# EAGLE design SparkFun_SOIC8-DIP-Adapter (EAGLE 7.3.0)
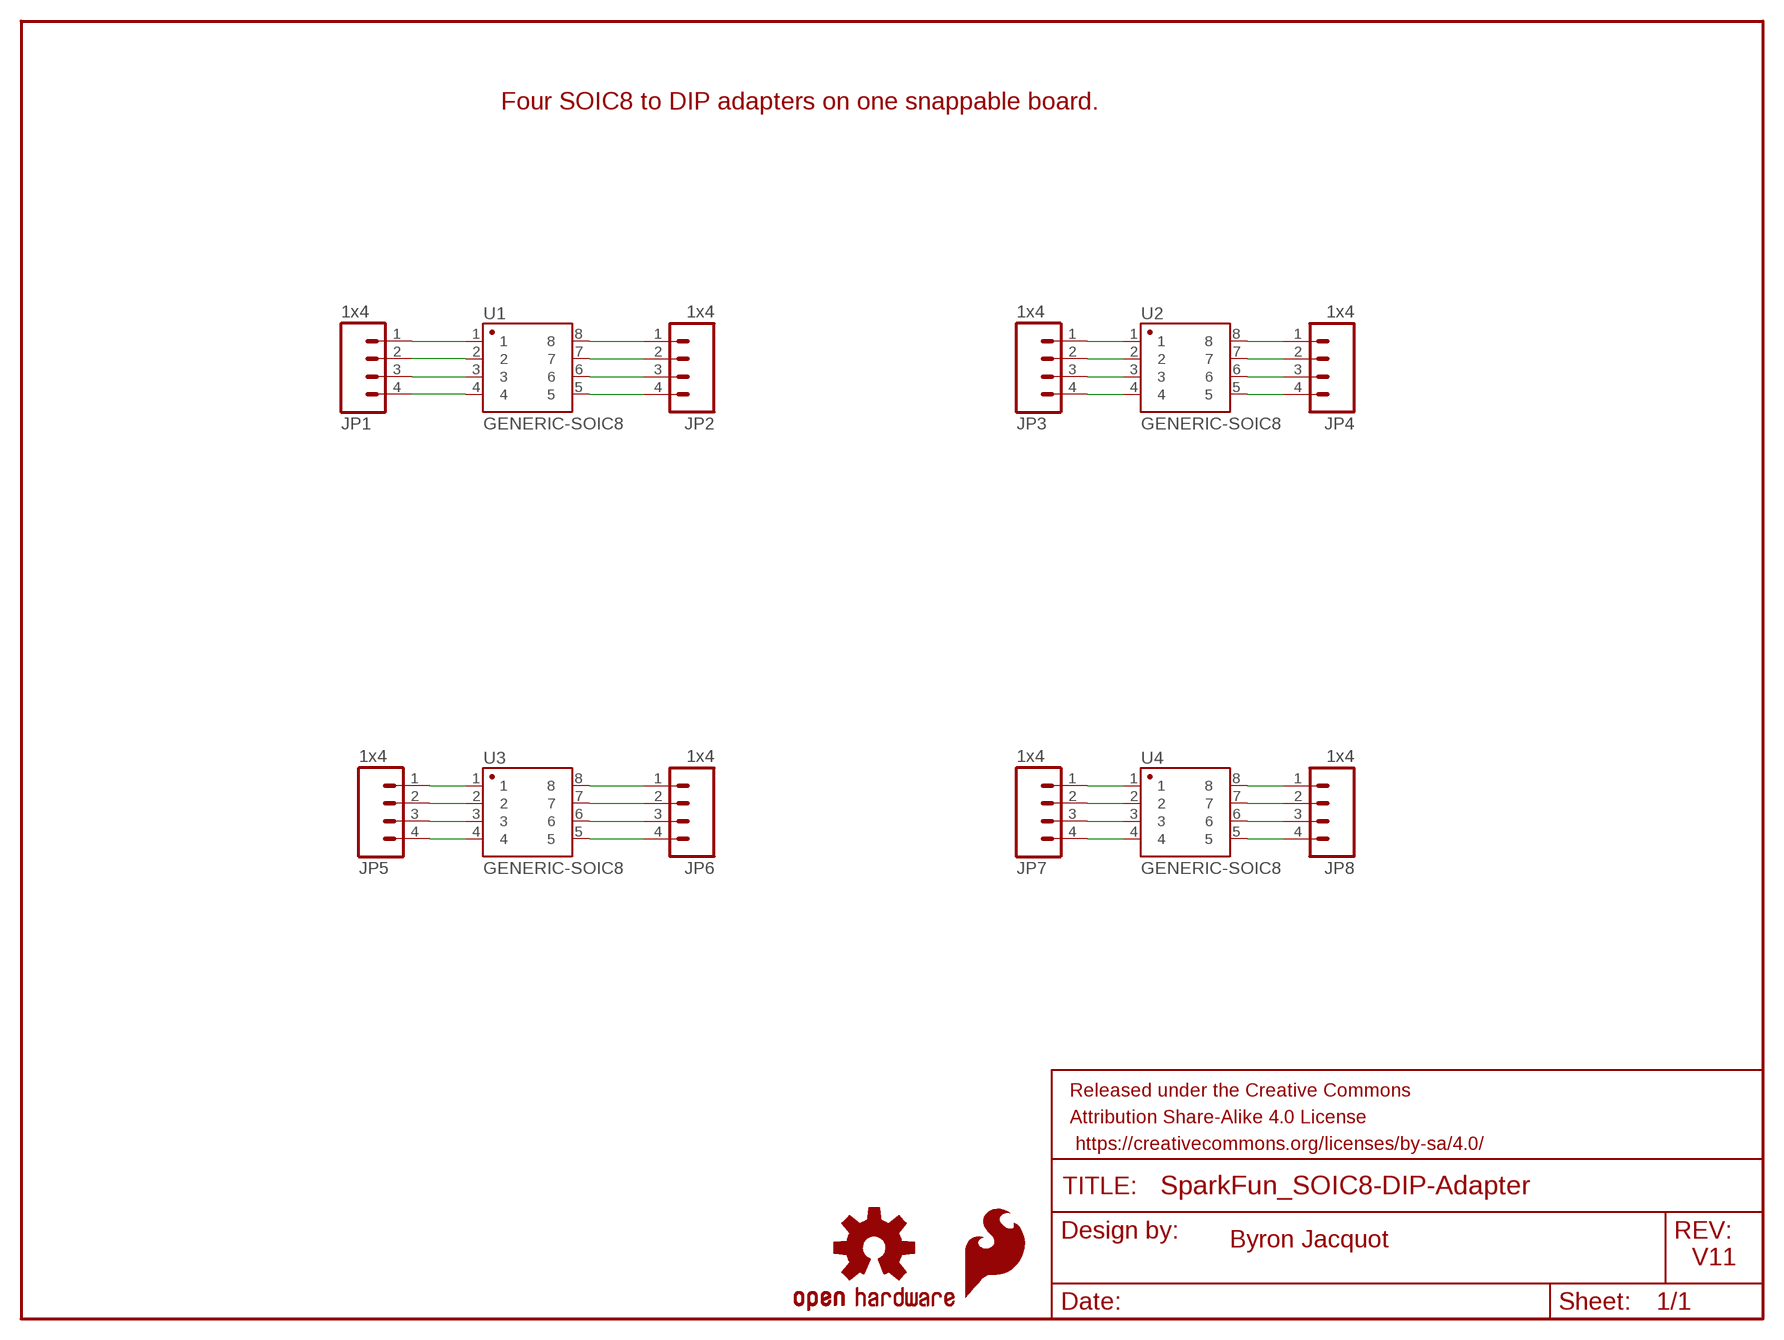
[diagram p0: schematic, sheet 1]

## Parts
FRAME1  frame  FRAME-LETTER  [CREATIVE_COMMONS]
JP1  1x4  M041X04_NO_SILK  [1X04_NO_SILK]
JP2  1x4  M04NO_SILK_ALL_ROUND  [1X04_NO_SILK_ALL_ROUND]
JP3  1x4  M041X04_NO_SILK  [1X04_NO_SILK]
JP4  1x4  M04NO_SILK_ALL_ROUND  [1X04_NO_SILK_ALL_ROUND]
JP5  1x4  M041X04_NO_SILK  [1X04_NO_SILK]
JP6  1x4  M04NO_SILK_ALL_ROUND  [1X04_NO_SILK_ALL_ROUND]
JP7  1x4  M041X04_NO_SILK  [1X04_NO_SILK]
JP8  1x4  M04NO_SILK_ALL_ROUND  [1X04_NO_SILK_ALL_ROUND]
LOGO1  SFE_LOGO_FLAME.1_INCH  [SFE_LOGO_FLAME_.1]
LOGO2  OSHW-LOGOS  [OSHW-LOGO-S]
U1  GENERIC-SOIC8  [SO08-UNIVERSAL]
U2  GENERIC-SOIC8  [SO08-UNIVERSAL]
U3  GENERIC-SOIC8  [SO08-UNIVERSAL]
U4  GENERIC-SOIC8  [SO08-UNIVERSAL]

## Nets
N$1: JP1.1 U1.1
N$2: JP1.2 U1.2
N$3: JP1.3 U1.3
N$4: JP1.4 U1.4
N$5: JP2.1 U1.8
N$6: JP2.2 U1.7
N$7: JP2.3 U1.6
N$8: JP2.4 U1.5
N$9: JP3.1 U2.1
N$10: JP3.2 U2.2
N$11: JP3.3 U2.3
N$12: JP3.4 U2.4
N$13: JP4.1 U2.8
N$14: JP4.2 U2.7
N$15: JP4.3 U2.6
N$16: JP4.4 U2.5
N$17: JP5.1 U3.1
N$18: JP5.2 U3.2
N$19: JP5.3 U3.3
N$20: JP5.4 U3.4
N$21: JP6.4 U3.5
N$22: JP6.3 U3.6
N$23: JP6.2 U3.7
N$24: JP6.1 U3.8
N$25: JP7.1 U4.1
N$26: JP7.2 U4.2
N$27: JP7.3 U4.3
N$28: JP7.4 U4.4
N$29: JP8.1 U4.8
N$30: JP8.2 U4.7
N$31: JP8.3 U4.6
N$32: JP8.4 U4.5

## Notes on the sheet
- Four SOIC8 to DIP adapters on one snappable board.
- Byron Jacquot
- V11

## Library data of the parts
FRAME1 = SparkFun-Aesthetics:FRAME-LETTER: Schematic Frame Standard 8.5x11 US Letter frame
JP1-JP8 = SparkFun-Connectors:M04: Header 4 Standard 4-pin 0.1" header. Use with straight break away headers (SKU : PRT-00116), right angle break away headers (PRT-00553), swiss pins (PRT-00743), machine pins (PRT-00117), and female headers (PRT-00115). Molex polarized connector foot print use with SKU : PRT-08231 with associated crimp pins and housings. 1MM SMD Version SKU: PRT-10208
LOGO1 = SparkFun-Aesthetics:SFE_LOGO_FLAME: SFE Logo, flame only This is the SparkFun flame logo. The logo on the schematic will always be the same size; the package variant is the height of the flame. Default layer for the logo on the board is tSilk.
LOGO2 = SparkFun-Aesthetics:OSHW-LOGO: Open Source Hardware Logo This logo indicates the piece of hardware it is found on incorporates a OSHW license and/or adheres to the definition of open source hardware found here: http://freedomdefined.org/OSHW
U1-U4 = SparkFun-AnalogIC:GENERIC-SOIC8: A placeholder for generic narrow & wide SOIC8 foorptints - used on the DIP adapter board.

## Board
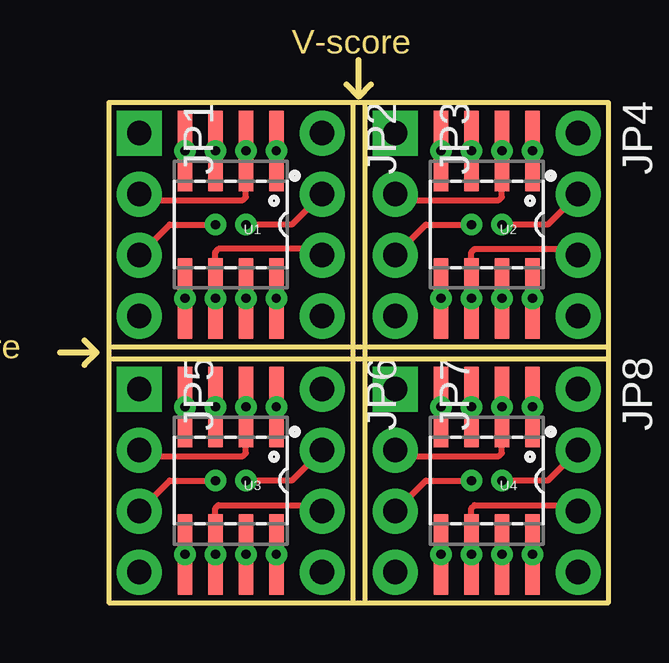
[diagram p1: board, top side]
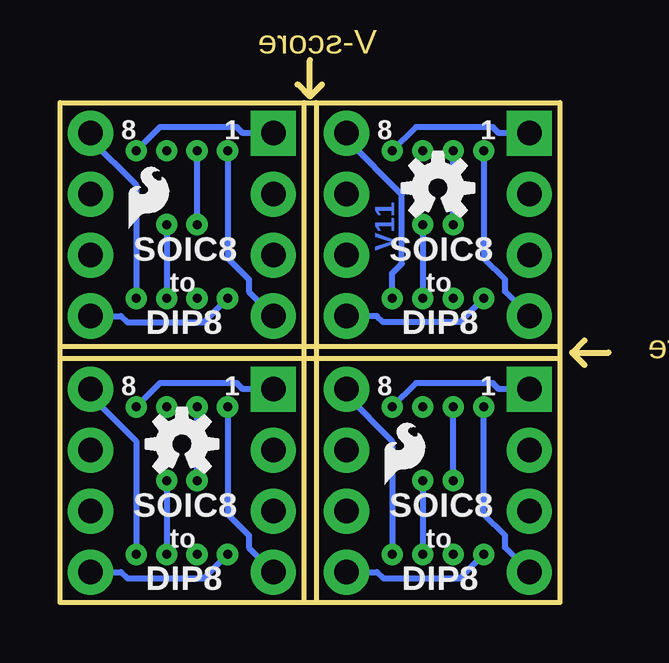
[diagram p2: board, bottom side, seen from below]

Size 22.86 x 22.61 mm. Coordinates in mm from the lower left corner, seen from the top.
Outline: 12.7,0 2.03,0 2.03,10.67
Outline: 22.86,10.67 22.86,0 12.7,0
Outline: 22.86,10.67 22.86,20.83 12.7,20.83
Outline: 12.7,20.83 2.03,20.83 2.03,10.67
Outline: 2.03,10.16 22.86,10.16
Outline: 12.19,20.83 12.19,0
Outline: 12.7,20.83 12.7,0
Outline: 2.03,10.67 22.86,10.67
Outline: 11.94,21.59 12.45,21.08 12.95,21.59
Outline: 12.45,21.34 12.45,22.61
Outline: 1.02,9.91 1.52,10.41 1.02,10.92
Outline: 1.27,10.41 0,10.41
Copper layers (1*16): Top 0.035mm / dielectric 1.5mm / Bottom 0.035mm
Design rules "SparkFun-2-layer *": minimum track width 7mil, minimum drill 15mil, track to track 8mil, track to pad 8mil, pad to pad 8mil, via to via 8mil, smd to smd 8mil, copper to edge 8mil, drill to drill 8mil, minimum pad ring 12mil, minimum via ring 10mil, stop-mask expansion 4mil, vias tented up to drill 20mil, thermal gap 10mil

### Footprints (pad centres in the part's own frame; a part is rotated, then mirrored left to right if it is on the bottom)
1X04_NO_SILK = drill 1.016 pad 1.88 square: 1 0,0 | drill 1.016 pad 1.88: 2 2.54,0; 3 5.08,0; 4 7.62,0
1X04_NO_SILK_ALL_ROUND = drill 1.016 pad 1.88: 1 0,0; 2 2.54,0; 3 5.08,0; 4 7.62,0
SO08-UNIVERSAL = smd 0.61 x 3.353: 1 -1.905,-3.073; 2 -0.635,-3.073; 3 0.635,-3.073; 4 1.905,-3.073; 5 1.905,3.073; 6 0.635,3.073; 7 -0.635,3.073; 8 -1.905,3.073

### Placement (x,y rotation side)
FRAME1  -13.21,-17.78 0 top  (outside the outline)
JP1  3.3,19.56 270 top
JP2  10.92,19.56 270 top
JP3  13.97,19.56 270 top
JP4  21.59,19.56 270 top
JP5  3.3,8.89 270 top
JP6  10.92,8.89 270 top
JP7  13.97,8.89 270 top
JP8  21.59,8.89 270 top
LOGO1  20.32,15.24 0 bottom
LOGO2  7.11,17.27 0 bottom
LOGO3  OSHW-LOGOS  [OSHW-LOGO-S]  17.78,6.6 0 bottom
LOGO4  SFE_LOGO_FLAME.1_INCH  [SFE_LOGO_FLAME_.1@1]  9.65,4.57 0 bottom
U1  7.11,15.75 180 top
U2  17.78,15.75 180 top
U3  7.11,5.08 180 top
U4  17.78,5.08 180 top

### Tracks (layer width: path | path; a pad name or v marks a point on that pad's centre or on a via)
N$1  (via drill 0.38)
  Bottom 0.254: U1.1 8.03,19.81 4.83,19.81 4.57,19.56 JP1.1
  other vias: 9.02,18.82
N$2  (via drill 0.38)
  Top 0.254: JP1.2 3.56,16.76 7.62,16.76 7.75,16.89 U1.2
  other vias: 7.75,18.82
N$3  (via drill 0.38)
  Top 0.254: JP1.3 4.57,15.75 v6.48,15.75
  Bottom 0.254: v6.48,15.75 U1.3
  other vias: 6.48,18.82
N$4  (via drill 0.38)
  Bottom 0.254: JP1.4 4.32,12.95 4.32,13.46 5.21,14.35 U1.4
  other vias: 5.21,18.82
N$5  (via drill 0.38)
  Top 0.254: U1.8 9.02,12.06 9.14,11.94
  Bottom 0.254: JP2.1 10.92,19.3 8.61,16.99 8.61,14.12 9.02,13.72 U1.8
  other vias: 9.02,12.67
N$6  (via drill 0.38)
  Top 0.254: v7.75,15.75 9.65,15.75 JP2.2
  Bottom 0.254: v7.75,15.75 U1.7
  other vias: 7.75,12.67
N$7  (via drill 0.38)
  Top 0.254: U1.6 6.48,14.61 6.6,14.73 10.67,14.73 JP2.3
  other vias: 6.48,12.67
N$8  (via drill 0.38)
  Bottom 0.254: JP2.4 9.65,11.94 9.4,11.68 6.2,11.68 U1.5
  other vias: 5.21,12.67
N$9  (via drill 0.38)
  Bottom 0.254: JP3.1 15.24,19.56 15.49,19.81 18.69,19.81 U2.1
  other vias: 19.68,18.82
N$10  (via drill 0.38)
  Top 0.254: JP3.2 14.22,16.76 18.29,16.76 18.41,16.89 U2.2
  other vias: 18.41,18.82
N$11  (via drill 0.38)
  Top 0.254: JP3.3 15.24,15.75 v17.14,15.75
  Bottom 0.254: v17.14,15.75 U2.3
  other vias: 17.14,18.82
N$12  (via drill 0.38)
  Bottom 0.254: U2.4 15.88,14.35 14.99,13.46 14.99,12.95 JP3.4
  other vias: 15.88,18.82
N$13  (via drill 0.38)
  Bottom 0.254: JP4.1 21.59,19.3 19.68,17.4 U2.8
  other vias: 19.68,12.67
N$14  (via drill 0.38)
  Top 0.254: JP4.2 20.32,15.75 v18.41,15.75
  Bottom 0.254: v18.41,15.75 U2.7
  other vias: 18.41,12.67
N$15  (via drill 0.38)
  Top 0.254: U2.6 17.14,14.61 17.27,14.73 21.34,14.73 JP4.3
  other vias: 17.14,12.67
N$16  (via drill 0.38)
  Bottom 0.254: JP4.4 20.32,11.94 20.07,11.68 16.87,11.68 U2.5
  other vias: 15.88,12.67
N$17  (via drill 0.38)
  Bottom 0.254: JP5.1 4.57,8.89 4.83,9.14 8.03,9.14 U3.1
  other vias: 9.02,8.15
N$18  (via drill 0.38)
  Top 0.254: JP5.2 3.56,6.1 7.62,6.1 7.75,6.22 U3.2
  other vias: 7.75,8.15
N$19  (via drill 0.38)
  Top 0.254: JP5.3 4.57,5.08 v6.48,5.08
  Bottom 0.254: v6.48,5.08 U3.3
  other vias: 6.48,8.15
N$20  (via drill 0.38)
  Bottom 0.254: JP5.4 4.32,2.29 4.32,2.79 5.21,3.68 U3.4
  other vias: 5.21,8.15
N$21  (via drill 0.38)
  Bottom 0.254: JP6.4 9.65,1.27 9.4,1.02 6.2,1.02 U3.5
  other vias: 5.21,2.01
N$22  (via drill 0.38)
  Top 0.254: U3.6 6.48,3.94 6.6,4.06 10.67,4.06 JP6.3
  other vias: 6.48,2.01
N$23  (via drill 0.38)
  Top 0.254: JP6.2 9.65,5.08 v7.75,5.08
  Bottom 0.254: v7.75,5.08 U3.7
  other vias: 7.75,2.01
N$24  (via drill 0.38)
  Bottom 0.254: JP6.1 10.92,8.64 9.02,6.73 U3.8
  other vias: 9.02,2.01
N$25  (via drill 0.38)
  Bottom 0.254: JP7.1 15.24,8.89 15.49,9.14 18.69,9.14 U4.1
  other vias: 19.68,8.15
N$26  (via drill 0.38)
  Top 0.254: JP7.2 14.22,6.1 18.29,6.1 18.41,6.22 U4.2
  other vias: 18.41,8.15
N$27  (via drill 0.38)
  Top 0.254: JP7.3 15.24,5.08 v17.14,5.08
  Bottom 0.254: v17.14,5.08 U4.3
  other vias: 17.14,8.15
N$28  (via drill 0.38)
  Bottom 0.254: U4.4 15.88,3.68 14.99,2.79 14.99,2.29 JP7.4
  other vias: 15.88,8.15
N$29  (via drill 0.38)
  Bottom 0.254: JP8.1 21.59,8.64 19.68,6.73 U4.8
  other vias: 19.68,2.01
N$30  (via drill 0.38)
  Top 0.254: JP8.2 20.32,5.08 v18.41,5.08
  Bottom 0.254: v18.41,5.08 U4.7
  other vias: 18.41,2.01
N$31  (via drill 0.38)
  Top 0.254: U4.6 17.14,3.94 17.27,4.06 21.34,4.06 JP8.3
  other vias: 17.14,2.01
N$32  (via drill 0.38)
  Bottom 0.254: JP8.4 20.32,1.27 20.07,1.02 16.87,1.02 U4.5
  other vias: 15.88,2.01

### Text on the board
Bottom: V11
Dimension: V-score | V-score
bPlace: 1 | 8 | 1 | 8 | SOIC8 | SOIC8 | to | to | DIP8 | DIP8 | 1 | 8 | 1 | 8 | SOIC8 | SOIC8 | to | to | DIP8 | DIP8
tDocu: Byron Jacquot